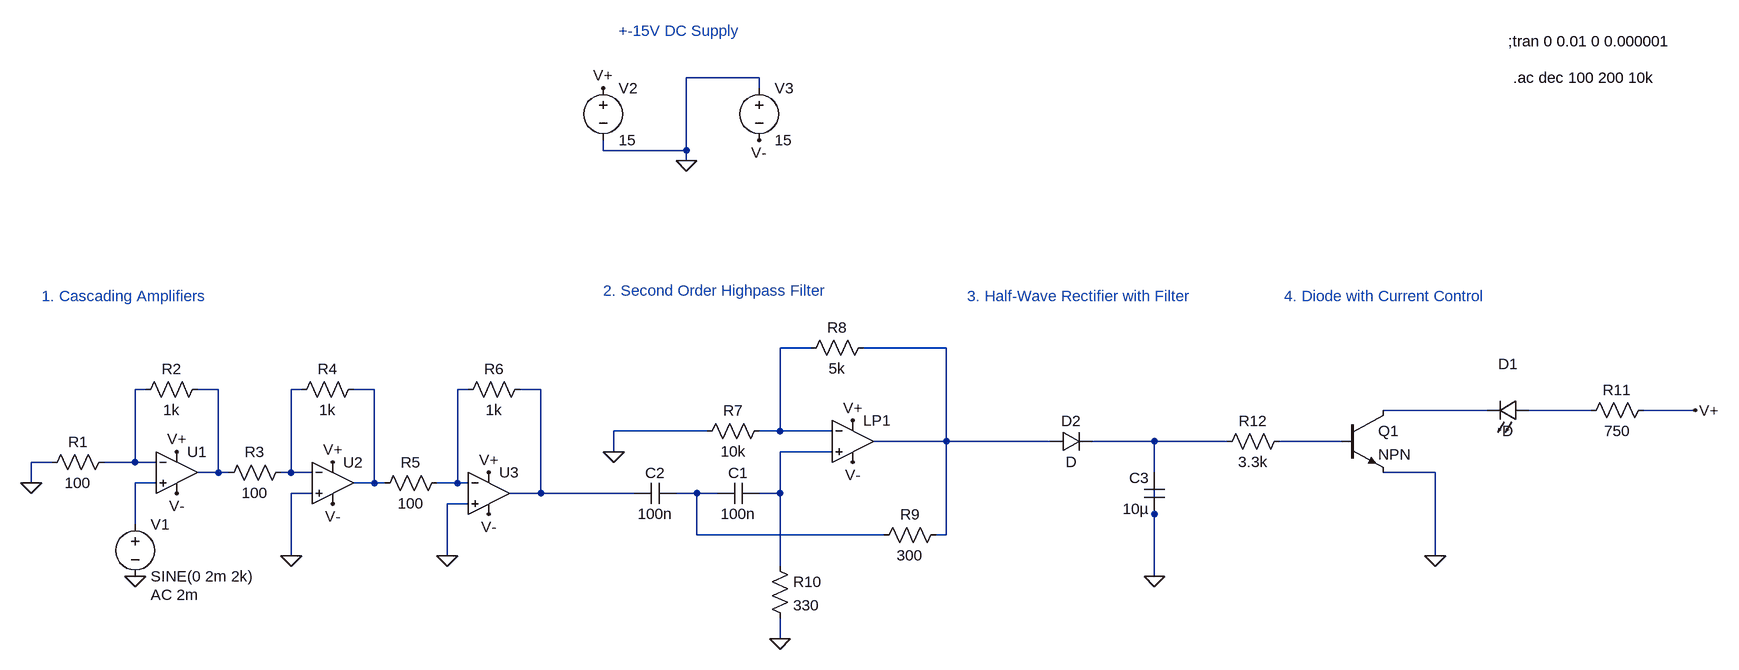
[diagram p0: schematic HP_TEST.asc]
HP_TEST.asc, the LTspice schematic file:
Version 4
SHEET 1 2308 680
WIRE 816 -464 704 -464
WIRE 816 -448 816 -464
WIRE 576 -352 576 -368
WIRE 704 -352 704 -464
WIRE 704 -352 576 -352
WIRE 704 -336 704 -352
WIRE 896 -48 848 -48
WIRE 1104 -48 976 -48
WIRE -128 16 -144 16
WIRE -16 16 -48 16
WIRE 112 16 96 16
WIRE 224 16 192 16
WIRE 368 16 352 16
WIRE 480 16 448 16
WIRE 1936 48 1776 48
WIRE 2096 48 2000 48
WIRE 2256 48 2176 48
WIRE 736 80 592 80
WIRE 848 80 848 -48
WIRE 848 80 816 80
WIRE 928 80 848 80
WIRE 1104 96 1104 -48
WIRE 1104 96 992 96
WIRE 1264 96 1104 96
WIRE 1424 96 1328 96
WIRE 1536 96 1424 96
WIRE 1712 96 1616 96
WIRE 592 112 592 80
WIRE 928 112 848 112
WIRE -272 128 -304 128
WIRE -144 128 -144 16
WIRE -144 128 -192 128
WIRE -112 128 -144 128
WIRE -16 144 -16 16
WIRE -16 144 -48 144
WIRE 0 144 -16 144
WIRE 96 144 96 16
WIRE 96 144 80 144
WIRE 128 144 96 144
WIRE 1424 144 1424 96
WIRE 1856 144 1776 144
WIRE -304 160 -304 128
WIRE -112 160 -144 160
WIRE 224 160 224 16
WIRE 224 160 192 160
WIRE 240 160 224 160
WIRE 352 160 352 16
WIRE 352 160 320 160
WIRE 368 160 352 160
WIRE 128 176 96 176
WIRE 480 176 480 16
WIRE 480 176 432 176
WIRE 624 176 480 176
WIRE 720 176 688 176
WIRE 752 176 720 176
WIRE 848 176 848 112
WIRE 848 176 816 176
WIRE 368 192 336 192
WIRE 1424 208 1424 160
WIRE -144 224 -144 160
WIRE 720 240 720 176
WIRE 1008 240 720 240
WIRE 1104 240 1104 96
WIRE 1104 240 1088 240
WIRE 96 272 96 176
WIRE 336 272 336 192
WIRE 1856 272 1856 144
WIRE 848 288 848 176
WIRE 1424 304 1424 208
WIRE 848 400 848 368
FLAG 400 144 V+
FLAG 160 128 V+
FLAG -80 112 V+
FLAG 400 208 V-
FLAG 160 192 V-
FLAG -80 176 V-
FLAG -304 160 0
FLAG 96 272 0
FLAG 336 272 0
FLAG -144 304 0
FLAG 960 64 V+
FLAG 592 112 0
FLAG 960 128 V-
FLAG 1856 272 0
FLAG 1424 304 0
FLAG 2256 48 V+
FLAG 848 400 0
FLAG 704 -336 0
FLAG 576 -448 V+
FLAG 816 -368 V-
SYMBOL OpAmps\\UniversalOpAmp -80 144 R0
SYMATTR InstName U1
SYMBOL OpAmps\\UniversalOpAmp 160 160 R0
SYMATTR InstName U2
SYMBOL OpAmps\\UniversalOpAmp 400 176 R0
SYMATTR InstName U3
SYMBOL res -176 112 R90
WINDOW 0 0 56 VBottom 2
WINDOW 3 32 56 VTop 2
SYMATTR InstName R1
SYMATTR Value 100
SYMBOL res -32 0 R90
WINDOW 0 0 56 VBottom 2
WINDOW 3 32 56 VTop 2
SYMATTR InstName R2
SYMATTR Value 1k
SYMBOL res 96 128 R90
WINDOW 0 0 56 VBottom 2
WINDOW 3 32 56 VTop 2
SYMATTR InstName R3
SYMATTR Value 100
SYMBOL res 208 0 R90
WINDOW 0 0 56 VBottom 2
WINDOW 3 32 56 VTop 2
SYMATTR InstName R4
SYMATTR Value 1k
SYMBOL res 336 144 R90
WINDOW 0 0 56 VBottom 2
WINDOW 3 32 56 VTop 2
SYMATTR InstName R5
SYMATTR Value 100
SYMBOL res 464 0 R90
WINDOW 0 0 56 VBottom 2
WINDOW 3 32 56 VTop 2
SYMATTR InstName R6
SYMATTR Value 1k
SYMBOL voltage -144 208 R0
WINDOW 123 24 124 Left 2
WINDOW 39 0 0 Left 0
SYMATTR Value2 AC 2m
SYMATTR InstName V1
SYMATTR Value SINE(0 2m 2k)
SYMBOL OpAmps/UniversalOpAmp 960 96 R0
SYMATTR InstName LP1
SYMBOL res 832 64 R90
WINDOW 0 0 56 VBottom 2
WINDOW 3 32 56 VTop 2
SYMATTR InstName R7
SYMATTR Value 10k
SYMBOL res 992 -64 R90
WINDOW 0 0 56 VBottom 2
WINDOW 3 32 56 VTop 2
SYMATTR InstName R8
SYMATTR Value 5k
SYMBOL npn 1712 48 R0
SYMATTR InstName Q1
SYMBOL LED 2000 64 M270
WINDOW 0 72 32 VTop 2
WINDOW 3 0 32 VBottom 2
SYMATTR InstName D1
SYMBOL res 2192 32 R90
WINDOW 0 0 56 VBottom 2
WINDOW 3 32 56 VTop 2
SYMATTR InstName R11
SYMATTR Value 750
SYMBOL diode 1264 112 R270
WINDOW 0 32 32 VTop 2
WINDOW 3 0 32 VBottom 2
SYMATTR InstName D2
SYMBOL cap 1440 208 R180
WINDOW 0 24 56 Left 2
WINDOW 3 24 8 Left 2
SYMATTR InstName C3
SYMATTR Value 10µ
SYMBOL res 1632 80 R90
WINDOW 0 0 56 VBottom 2
WINDOW 3 32 56 VTop 2
SYMATTR InstName R12
SYMATTR Value 3.3k
SYMBOL res 1104 224 R90
WINDOW 0 0 56 VBottom 2
WINDOW 3 32 56 VTop 2
SYMATTR InstName R9
SYMATTR Value 300
SYMBOL cap 816 160 R90
WINDOW 0 0 32 VBottom 2
WINDOW 3 32 32 VTop 2
SYMATTR InstName C1
SYMATTR Value 100n
SYMBOL cap 688 160 R90
WINDOW 0 0 32 VBottom 2
WINDOW 3 32 32 VTop 2
SYMATTR InstName C2
SYMATTR Value 100n
SYMBOL res 832 272 R0
SYMATTR InstName R10
SYMATTR Value 330
SYMBOL voltage 576 -464 R0
SYMATTR InstName V2
SYMATTR Value 15
SYMBOL voltage 816 -464 R0
SYMATTR InstName V3
SYMATTR Value 15
TEXT -288 -128 Left 2 ;1. Cascading Amplifiers
TEXT 576 -136 Left 2 ;2. Second Order Highpass Filter
TEXT 1136 -128 Left 2 ;3. Half-Wave Rectifier with Filter
TEXT 1624 -128 Left 2 ;4. Diode with Current Control
TEXT 1968 -520 Left 2 !;tran 0 0.01 0 0.000001
TEXT 600 -536 Left 2 ;+-15V DC Supply
TEXT 1976 -464 Left 2 !.ac dec 100 200 10k

The netlist it stands for:
* HP_TEST.asc
XU1 N014 N003 V+ V- N004 level1 Avol=1Meg GBW=10Meg Vos=0 En=0 Enk=0 In=0 Ink=0 Rin=500Meg  ; pins In+ In- V+ V- OUT
XU2 0 N005 V+ V- N006 level1 Avol=1Meg GBW=10Meg Vos=0 En=0 Enk=0 In=0 Ink=0 Rin=500Meg  ; pins In+ In- V+ V- OUT
XU3 0 N007 V+ V- N008 level1 Avol=1Meg GBW=10Meg Vos=0 En=0 Enk=0 In=0 Ink=0 Rin=500Meg  ; pins In+ In- V+ V- OUT
R1 N003 0 100
R2 N004 N003 1k
R3 N005 N004 100
R4 N006 N005 1k
R5 N007 N006 100
R6 N008 N007 1k
V1 N014 0 SINE(0 2m 2k) AC 2m
XLP1 N013 N001 V+ V- N002 level1 Avol=1Meg GBW=10Meg Vos=0 En=0 Enk=0 In=0 Ink=0 Rin=500Meg  ; pins In+ In- V+ V- OUT
R7 N001 0 10k
R8 N002 N001 5k
Q1 N009 N012 0 0 NPN
D1 N010 N009 D
R11 V+ N010 750
D2 N002 N011 D
C3 0 N011 10µ
R12 N012 N011 3.3k
R9 N002 N015 300
C1 N013 N015 100n
C2 N015 N008 100n
R10 N013 0 330
V2 V+ 0 15
V3 0 V- 15
.model D D
.lib standard.dio
.model NPN NPN
.model PNP PNP
.lib standard.bjt
* 1. Cascading Amplifiers
* 2. Second Order Highpass Filter
* 3. Half-Wave Rectifier with Filter
* 4. Diode with Current Control
;tran 0 0.01 0 0.000001
* +-15V DC Supply
.ac dec 100 200 10k
.lib UniversalOpAmp1.lib
.backanno
.end